# Altium project IOT_CPU_v0.PrjPcb
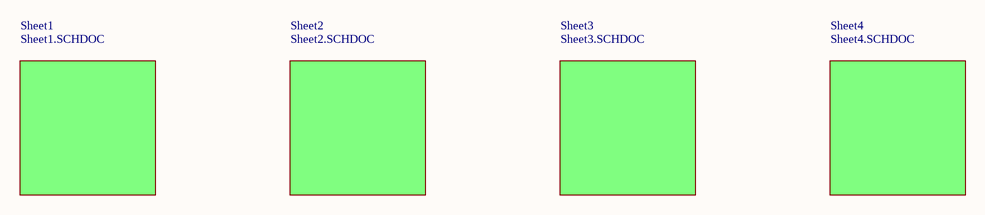
[diagram p0: First_Sheet.SCHDOC]
4 sheets, 118 parts. Net scope: global (net labels, ports and power ports of the same name join across sheets).
Board file: IOT_CPU_v0.PcbDoc
Sheets:
  First_Sheet.SCHDOC
    Sheet1 = Sheet1.SCHDOC
    Sheet3 = Sheet3.SCHDOC
    Sheet4 = Sheet4.SCHDOC

## Sheet First_Sheet.SCHDOC
size 593 x 439 mm

### Sub-sheets
Sheet1 = Sheet1.SCHDOC: no entries
Sheet2 = Sheet2.SCHDOC (file not in this document): no entries
Sheet3 = Sheet3.SCHDOC: no entries
Sheet4 = Sheet4.SCHDOC: no entries

## Sheet Sheet1.SCHDOC
size 593 x 439 mm; ApprovedBy: ГрибановСВ; CheckedBy: КычкинАВ; Author: СергеевДС; DocumentNumber: ЕМС.02.00.200 Э3; SheetNumber: 1; SheetTotal: 4; DocumentName: Sheet1.SCHDOC
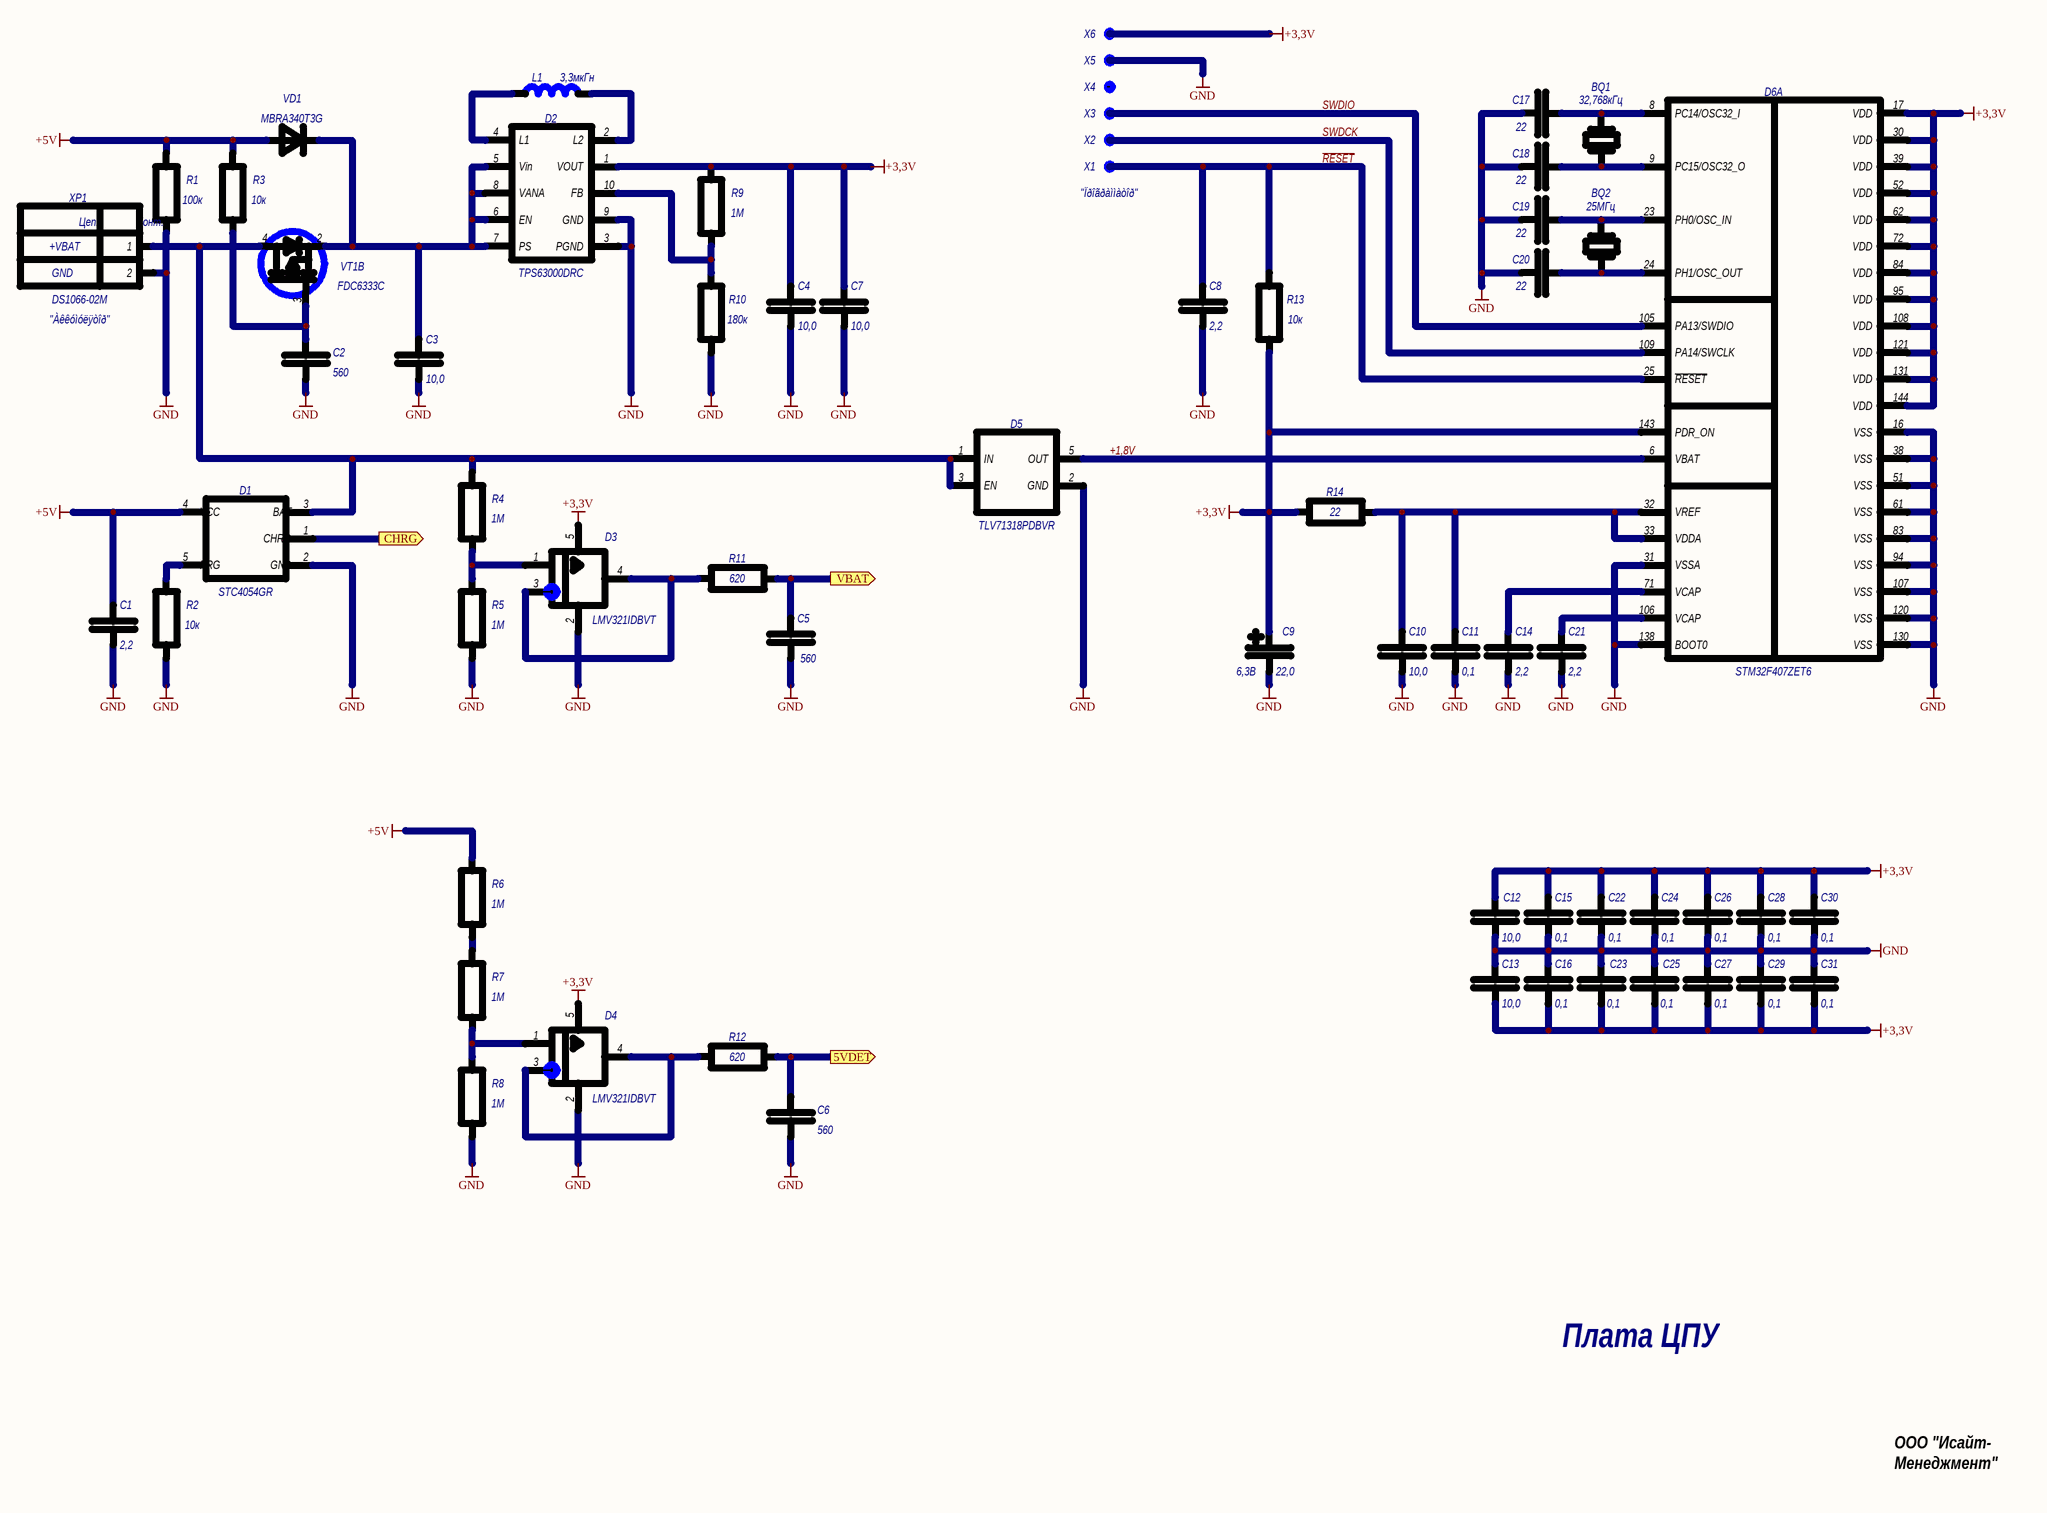
[diagram p1: Sheet1.SCHDOC]

### Parts
BQ1  DT38-32K768  [DT38]  (value not drawn)
BQ2  HC49U-06M  [HC49U]  (value not drawn)
C1  value 2,2  [0805]  (hidden comment: К0805)
C2  value 560  [0805]  (hidden comment: К0805)
C3  value 10,0  [0805]  (hidden comment: К0805)
C4  value 10,0  [0805]  (hidden comment: К0805)
C5  value 560  [0805]  (hidden comment: К0805)
C6  value 560  [0805]  (hidden comment: К0805)
C7  value 10,0  [0805]  (hidden comment: К0805)
C8  value 2,2  [0805]  (hidden comment: К0805)
C9  value 22,0  TG: 6,3В  [TANTAL]  (hidden comment: КТ)
C10  value 10,0  [0805]  (hidden comment: К0805)
C11  value 0,1  [0805]  (hidden comment: К0805)
C12  value 10,0  [0805]  (hidden comment: К0805)
C13  value 10,0  [0805]  (hidden comment: К0805)
C14  value 2,2  [0805]  (hidden comment: К0805)
C15  value 0,1  [0805]  (hidden comment: К0805)
C16  value 0,1  [0805]  (hidden comment: К0805)
C17  value 22  [0805]  (hidden comment: К0805)
C18  value 22  [0805]  (hidden comment: К0805)
C19  value 22  [0805]  (hidden comment: К0805)
C20  value 22  [0805]  (hidden comment: К0805)
C21  value 2,2  [0805]  (hidden comment: К0805)
C22  value 0,1  [0805]  (hidden comment: К0805)
C23  value 0,1  [0805]  (hidden comment: К0805)
C24  value 0,1  [0805]  (hidden comment: К0805)
C25  value 0,1  [0805]  (hidden comment: К0805)
C26  value 0,1  [0805]  (hidden comment: К0805)
C27  value 0,1  [0805]  (hidden comment: К0805)
C28  value 0,1  [0805]  (hidden comment: К0805)
C29  value 0,1  [0805]  (hidden comment: К0805)
C30  value 0,1  [0805]  (hidden comment: К0805)
C31  value 0,1  [0805]  (hidden comment: К0805)
D1  STC4054GR  [SOT-23-5]
D2  TPS63000DRC  [VSON-10]
D3  LMV321IDBVT  [SOT-23-5]
D4  LMV321IDBVT  [SOT-23-5]
D5  TLV71318PDBVR  [SOT-23-5]
D6  STM32F407ZET6  [LQFP-144]  (part A of 4)
L1  SRN3015-101M  [SRN3015]  (value not drawn)
R1  Р0805  [0805]  (value not drawn)
R2  Р0805  [0805]  (value not drawn)
R3  Р0805  [0805]  (value not drawn)
R4  value 1M  [0805]  (hidden comment: Р0805)
R5  value 1M  [0805]  (hidden comment: Р0805)
R6  value 1M  [0805]  (hidden comment: Р0805)
R7  value 1M  [0805]  (hidden comment: Р0805)
R8  value 1M  [0805]  (hidden comment: Р0805)
R9  value 1M  [0805]  (hidden comment: Р0805)
R10  Р0805  [0805]  (value not drawn)
R11  value 620  [0805]  (hidden comment: Р0805)
R12  value 620  [0805]  (hidden comment: Р0805)
R13  Р0805  [0805]  (value not drawn)
R14  value 22  [0805]  (hidden comment: Р0805)
VD1  MBRA340T3G  [SMA]
VT1  FDC6333C  [SOT-23-6]  (part B of 2)
X1  X  [01]  (value not drawn)
X2  X  [01]  (value not drawn)
X3  X  [01]  (value not drawn)
X4  X  [01]  (value not drawn)
X5  X  [01]  (value not drawn)
X6  X  [01]  (value not drawn)
XP1  DS1066-02M  2: GND  1: +VBAT  [DS1066-02M]

### Ports
5VDET (out), CHRG (out), VBAT (out)

### Nets
+3,3V: C4.2 C7.2 C9.1(Plus) C12.1 C13.1 C15.2 C16.1 C22.2 C23.2 C24.2 C25.2 C26.2 C27.1 C28.2 C29.1 C30.2 C31.1 D2.1(VOUT) D3.5(V) D4.5(V) D6.17(VDD) D6.30(VDD) D6.39(VDD) D6.52(VDD) D6.62(VDD) D6.72(VDD) D6.84(VDD) D6.95(VDD) D6.108(VDD) D6.121(VDD) D6.131(VDD) D6.143(PDR_ON) D6.144(VDD) R9.2 R13.1 R14.2 X6.1
+5V: C1.2 D1.4(VCC) R1.2 R3.2 R6.2 VD1.A(Anod)
GND: C1.1 C2.1 C3.1 C4.1 C5.2 C6.1 C7.1 C8.1 C9.2(Minus) C10.1 C11.1 C12.2 C13.2 C14.1 C15.1 C16.2 C17.2 C18.2 C19.2 C20.2 C21.1 C22.1 C23.1 C24.1 C25.1 C26.1 C27.2 C28.1 C29.2 C30.1 C31.2 D1.2(GND) D2.3(PGND) D2.9(GND) D2.11(GND) D3.2(G) D4.2(G) D5.2(GND) D6.16(VSS) D6.31(VSSA) D6.38(VSS) D6.51(VSS) D6.61(VSS) D6.83(VSS) D6.94(VSS) D6.107(VSS) D6.120(VSS) D6.130(VSS) D6.138(BOOT0) R1.1 R2.1 R5.1 R8.1 R10.1 X5.1 XP1.2
5VDET: C6.2 R12.1 ; port 5VDET
+1,8V: D5.5(OUT) D6.6(VBAT)
CHRG: D1.1(CHRG) ; port CHRG
~{RESET}: C8.2 D6.25(~{RESET}) R13.2 X1.1
SWDCK: D6.109(PA14/SWCLK) X2.1
SWDIO: D6.105(PA13/SWDIO) X3.1
VBAT: C5.1 R11.1 ; port VBAT
NetBQ1_1: BQ1.1 C18.1 D6.9(PC15/OSC32_O)
NetBQ1_2: BQ1.2 C17.1 D6.8(PC14/OSC32_I)
NetBQ2_1: BQ2.1 C20.1 D6.24(PH1/OSC_OUT)
NetBQ2_2: BQ2.2 C19.1 D6.23(PH0/OSC_IN)
NetC2_2: C2.2 R3.1 VT1.3(Gate)
NetC3_2: C3.2 D2.5(Vin) D2.6(EN) D2.7(PS) D2.8(VANA) VD1.K(Katod) VT1.2(Source)
NetC10_2: C10.2 C11.2 D6.32(VREF) D6.33(VDDA) R14.1
NetC14_2: C14.2 D6.71(VCAP)
NetC21_2: C21.2 D6.106(VCAP)
NetD1_3: D1.3(BAT) D5.1(IN) D5.3(EN) R4.2 VT1.4(Drain) XP1.1
NetD1_5: D1.5(PRG) R2.2
NetD2_2: D2.2(L2) L1.2
NetD2_4: D2.4(L1) L1.1
NetD2_10: D2.10(FB) R9.1 R10.2
NetD3_1: D3.1(+IN) R4.1 R5.2
NetD3_3: D3.3(-IN) D3.4(OUT) R11.2
NetD4_1: D4.1(+IN) R7.2 R8.2
NetD4_3: D4.3(-IN) D4.4(OUT) R12.2
NetR6_1: R6.1 R7.1

Not connected (* = marked no-connect by the designer): D5 4; D6 49; X4 1

### Notes on the sheet
- (near X1) "Ïðîãðàììàòîð"
- (near XP1) "Àêêóìóëÿòîð"
- Плата ЦПУ
- ООО "Исайт-
  Менеджмент"
- Перв. примен.
- Справ. №
- Подп. и дата
- Инв. № дубл.
- Взам. инв. №
- Изм.
- Лист
- № докум.
- Подп.
- Дата
- Литера
- Масса
- Масштаб
- Пров.
- Разраб.
- О
- 1
- _
- Инв. № подл.
- Н.контр.
- Схема электрическая
  принципиальная
- Листов
- Утв.
- (in symbol DS1066-02M) Цепь; Конт.
- (in symbol DT38-32K768) 32,768кГц
- (in symbol HC49U-06M) 25МГц
- (in symbol SRN3015-101M) 3,3мкГн
- (in symbol Р0805) 100к; 10к; 180к

### Library data of the parts
BQ1 = DT38-32K768: РЕЗОНАТОР; TG: {TG}; TO: 020, 180/3x8/ASC327; TU: {TU}; NO: 0522; RefDes2: {RefDes2}; ComponentHeight: {ComponentHeight}
BQ2 = HC49U-06M: РЕЗОНАТОР; TG: {TG}; TO: 020, 211/-/6.000; TU: {TU}; NO: 2491; RefDes2: {RefDes2}; ComponentHeight: {ComponentHeight}
C1-C8 C10-C31 = К0805: КОНДЕНСАТОР; TG: NP0; TO: 5%; TU: {TU}; NO: {NO}; RefDes2: {RefDes2}; ComponentHeight: 1
C9 = КТ: КОНДЕНСАТОР; TU: {TU}; TO: {TO}; NO: {NO}; RefDes2: {RefDes2}; ComponentHeight: {ComponentHeight}
D1 = STC4054GR: {Description}; NO: {NO}; TG: {TG}; TO: {TO}; TU: {TU}; RefDes2: {RefDes2}; ComponentHeight: {ComponentHeight}
D2 = TPS63000DRC: {Description}; TU: {TU}; TG: {TG}; TO: {TO}; NO: {NO}; ComponentHeight: {ComponentHeight}
D3 D4 = LMV321IDBVT: {Description}; TU: {TU}; TG: {TG}; TO: {TO}; NO: {NO}; RefDes2: {RefDes2}; ComponentHeight: {ComponentHeight}
D5 = TLV71318PDBVR: {Description}; NO: {NO}; TG: {TG}; TO: {TO}; TU: {TU}; RefDes2: {RefDes2}; ComponentHeight: {ComponentHeight}
L1 = SRN3015-101M: {Description}; TU: {TU}; TO: {TO}; TG: {TG}; NO: {NO}; RefDes2: {RefDes2}; ComponentHeight: {ComponentHeight}
R1-R14 = Р0805: РЕЗИСТОР; TG: 0,125; TO: 1%; TU: {TU}; NO: {NO}; RefDes2: {RefDes2}; ComponentHeight: 1
VD1 = MBRA340T3G: {Description}; TU: {TU}; TG: {TG}; RefDes2: {RefDes2}; TO: {TO}; NO: {NO}; ComponentHeight: {ComponentHeight}
VT1 = FDC6333C: {Description}; TO: {TO}; TU: {TU}; NO: {NO}; RefDes2: {RefDes2}; TG: {TG}; ComponentHeight: {ComponentHeight}
X1-X6 = X: КОНТАКТ; TG: {TG}; TO: {TO}; TU: {TU}; NO: {NO}; RefDes2: {RefDes2}; ComponentHeight: 0.1
XP1 = DS1066-02M: {Description}; TU: {TU}; TG: {TG}; RefDes2: {RefDes2}; TO: {TO}; NO: {NO}; ComponentHeight: {ComponentHeight}

## Sheet Sheet3.SCHDOC
size 593 x 439 mm; DocumentNumber: ЕМС.02.00.200 Э3; SheetNumber: 3; SheetTotal: 4; DocumentName: Sheet3.SCHDOC
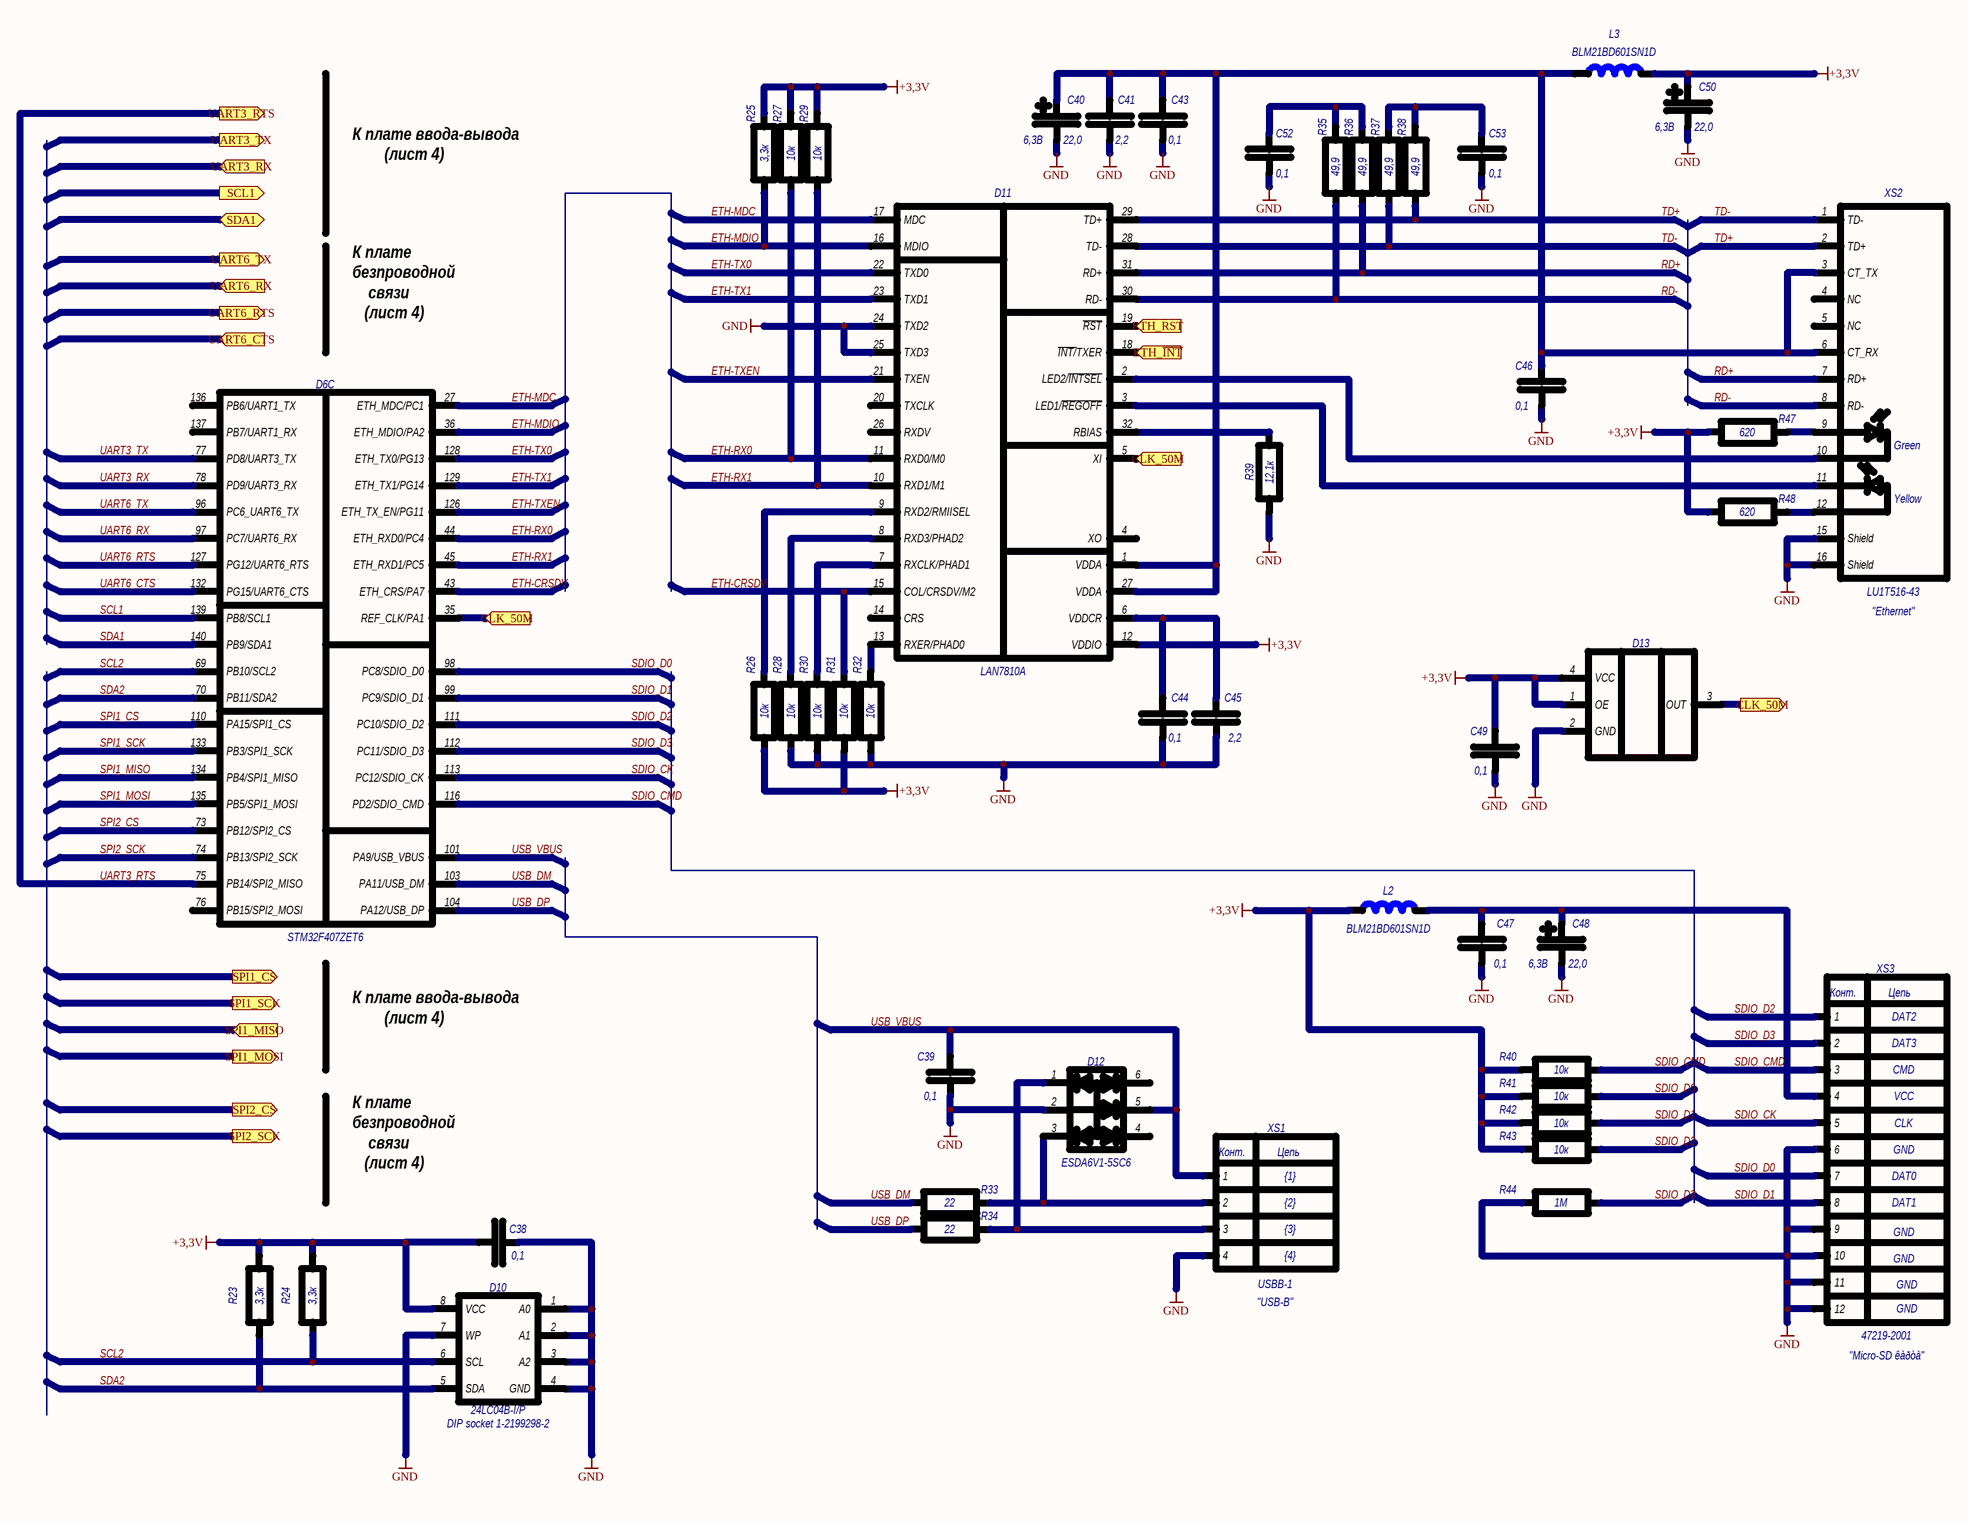
[diagram p2: Sheet3.SCHDOC]

### Parts
C38  value 0,1  [0805]  (hidden comment: К0805)
C39  value 0,1  [0805]  (hidden comment: К0805)
C40  value 22,0  TG: 6,3В  [TANTAL]  (hidden comment: КТ)
C41  value 2,2  [0805]  (hidden comment: К0805)
C43  value 0,1  [0805]  (hidden comment: К0805)
C44  value 0,1  [0805]  (hidden comment: К0805)
C45  value 2,2  [0805]  (hidden comment: К0805)
C46  value 0,1  [0805]  (hidden comment: К0805)
C47  value 0,1  [0805]  (hidden comment: К0805)
C48  value 22,0  TG: 6,3В  [TANTAL]  (hidden comment: КТ)
C49  value 0,1  [0805]  (hidden comment: К0805)
C50  value 22,0  TG: 6,3В  [TANTAL]  (hidden comment: КТ)
C52  value 0,1  [0805]  (hidden comment: К0805)
C53  value 0,1  [0805]  (hidden comment: К0805)
D6  STM32F407ZET6  [LQFP-144]  (part C of 4)
D10  24LC04B-I/P  value DIP socket 1-2199298-2  [DIP-08]
D11  LAN7810A  [QFN-32-5X5]
D12  ESDA6V1-5SC6  [SOT-23-6]
D13  KXO-V97  [SG0705]  (value not drawn)
L2  value BLM21BD601SN1D  [0805]  (hidden comment: BLM21BD222)
L3  value BLM21BD601SN1D  [0805]  (hidden comment: BLM21BD222)
R23  Р0805  [0805]  (value not drawn)
R24  Р0805  [0805]  (value not drawn)
R25  Р0805  [0805]  (value not drawn)
R26  Р0805  [0805]  (value not drawn)
R27  Р0805  [0805]  (value not drawn)
R28  Р0805  [0805]  (value not drawn)
R29  Р0805  [0805]  (value not drawn)
R30  Р0805  [0805]  (value not drawn)
R31  Р0805  [0805]  (value not drawn)
R32  Р0805  [0805]  (value not drawn)
R33  value 22  [0805]  (hidden comment: Р0805)
R34  value 22  [0805]  (hidden comment: Р0805)
R35  value 49,9  [0805]  (hidden comment: Р0805)
R36  value 49,9  [0805]  (hidden comment: Р0805)
R37  value 49,9  [0805]  (hidden comment: Р0805)
R38  value 49,9  [0805]  (hidden comment: Р0805)
R39  Р0805  [0805]  (value not drawn)
R40  Р0805  [0805]  (value not drawn)
R41  Р0805  [0805]  (value not drawn)
R42  Р0805  [0805]  (value not drawn)
R43  Р0805  [0805]  (value not drawn)
R44  value 1M  [0805]  (hidden comment: Р0805)
R47  value 620  [0805]  (hidden comment: Р0805)
R48  value 620  [0805]  (hidden comment: Р0805)
XS1  USBB-1  4: {4}  1: {1}  2: {2}  3: {3}  [USB-B]
XS2  LU1T516-43  [LU1T516-43]
XS3  47219-2001  10: GND  7: DAT0  5: CLK  4: VCC  2: DAT3  1: DAT2  8: DAT1  3: CMD  [47219-2001]

### Ports
CLK_50M (in), CLK_50M (out), ETH_RST (in), ETH_~{INT} (in), SCL1 (out), SDA1 (bidir), SPI1_CS (out), SPI1_MISO (in), SPI1_MOSI (out), SPI1_SCK (out), SPI2_CS (out), SPI2_SCK (out), UART3_RTS (out), UART3_RX (in), UART3_TX (out), UART6_CTS (in), UART6_RTS (out), UART6_RX (in), UART6_TX (out)

### Nets
+3,3V: C38.1 C49.2 C50.1(Plus) D10.8(VCC) D11.12(VDDIO) D13.1(OE) D13.4(VCC) L2.2 L3.2 R23.2 R24.2 R25.2 R26.2 R27.2 R29.2 R31.2 R40.2 R41.2 R42.2 R43.2 R47.1 R48.1
GND: C38.2 C39.1 C40.2(Minus) C41.2 C43.2 C44.2 C45.2 C46.1 C47.2 C48.2(Minus) C49.1 C50.2(Minus) C52.1 C53.1 D10.1(A0) D10.2(A1) D10.3(A2) D10.4(GND) D10.7(WP) D11.24(TXD2) D11.25(TXD3) D11.33(GND) D11.34(GND) D11.35(GND) D11.36(GND) D12.2 D13.2(GND) R28.2 R30.2 R32.2 R39.2 R44.2 XS1.4 XS2.15(Shield) XS2.16(Shield) XS3.6 XS3.9 XS3.10 XS3.11 XS3.12
CLK_50M: D6.35(REF_CLK/PA1) D11.5(XI) D13.3(OUT) ; port CLK_50M
ETH-CRSDV: D6.43(ETH_CRS/PA7) D11.15(COL/CRSDV/M2) R31.1
ETH-MDC: D6.27(ETH_MDC/PC1) D11.17(MDC)
ETH-MDIO: D6.36(ETH_MDIO/PA2) D11.16(MDIO) R25.1
ETH-RX0: D6.44(ETH_RXD0/PC4) D11.11(RXD0/M0) R27.1
ETH-RX1: D6.45(ETH_RXD1/PC5) D11.10(RXD1/M1) R29.1
ETH-TX0: D6.128(ETH_TX0/PG13) D11.22(TXD0)
ETH-TX1: D6.129(ETH_TX1/PG14) D11.23(TXD1)
ETH-TXEN: D6.126(ETH_TX_EN/PG11) D11.21(TXEN)
ETH_~{INT}: D11.18(~{INT/}TXER) ; port ETH_~{INT}
ETH_RST: D11.19(~{RST}) ; port ETH_RST
RD+: D11.31(RD+) R36.1 XS2.7(RD+)
RD-: D11.30(RD-) R35.1 XS2.8(RD-)
SCL1: D6.139(PB8/SCL1)
SCL2: D6.69(PB10/SCL2) D10.6(SCL) R24.1
SDA1: D6.140(PB9/SDA1)
SDA2: D6.70(PB11/SDA2) D10.5(SDA) R23.1
SDIO_CK: D6.113(PC12/SDIO_CK) XS3.5
SDIO_CMD: D6.116(PD2/SDIO_CMD) R40.1 XS3.3
SDIO_D0: D6.98(PC8/SDIO_D0) R41.1 XS3.7
SDIO_D1: D6.99(PC9/SDIO_D1) R42.1 XS3.8
SDIO_D2: D6.111(PC10/SDIO_D2) R43.1 XS3.1
SDIO_D3: D6.112(PC11/SDIO_D3) R44.1 XS3.2
SPI1_CS: D6.110(PA15/SPI1_CS)
SPI1_MISO: D6.134(PB4/SPI1_MISO)
SPI1_MOSI: D6.135(PB5/SPI1_MOSI)
SPI1_SCK: D6.133(PB3/SPI1_SCK)
SPI2_CS: D6.73(PB12/SPI2_CS)
SPI2_SCK: D6.74(PB13/SPI2_SCK)
TD+: D11.29(TD+) R38.1 XS2.2(TD+)
TD-: D11.28(TD-) R37.1 XS2.1(TD-)
UART3_RTS: D6.75(PB14/SPI2_MISO) ; port UART3_RTS
UART3_RX: D6.78(PD9/UART3_RX)
UART3_TX: D6.77(PD8/UART3_TX)
UART6_CTS: D6.132(PG15/UART6_CTS)
UART6_RTS: D6.127(PG12/UART6_RTS)
UART6_RX: D6.97(PC7/UART6_RX)
UART6_TX: D6.96(PC6_UART6_TX)
USB_DM: D6.103(PA11/USB_DM) R33.2
USB_DP: D6.104(PA12/USB_DP) R34.2
USB_VBUS: C39.2 D6.101(PA9/USB_VBUS) D12.5(C) XS1.1
NetC40_1: C40.1(Plus) C41.1 C43.1 C46.2 D11.1(VDDA) D11.27(VDDA) L3.1 XS2.3(CT_TX) XS2.6(CT_RX)
NetC44_1: C44.1 C45.1 D11.6(VDDCR)
NetC47_1: C47.1 C48.1(Plus) L2.1 XS3.4
NetC52_2: C52.2 R35.2 R36.2
NetC53_2: C53.2 R37.2 R38.2
NetD11_2: D11.2(LED2/~{INTSEL}) XS2.10
NetD11_3: D11.3(LED1/~{REGOFF}) XS2.11
NetD11_7: D11.7(RXCLK/PHAD1) R30.1
NetD11_8: D11.8(RXD3/PHAD2) R28.1
NetD11_9: D11.9(RXD2/RMIISEL) R26.1
NetD11_13: D11.13(RXER/PHAD0) R32.1
NetD11_32: D11.32(RBIAS) R39.1
NetD12_1: D12.1 R34.1 XS1.3
NetD12_3: D12.3 R33.1 XS1.2
NetR47_2: R47.2 XS2.9
NetR48_2: R48.2 XS2.12

Not connected (* = marked no-connect by the designer): D6 49 76(PB15/SPI2_MOSI) 136(PB6/UART1_TX) 137(PB7/UART1_RX); D11 4(XO) 14(CRS) 20(TXCLK) 26(RXDV); D12 4 6(C); XS2 4(NC) 5(NC) 13 14

### Notes on the sheet
- К плате ввода-вывода
  (лист 4)
- (near D6) К плате
  безпроводной
  связи
  (лист 4)
- (near XS2) "Ethernet"
- (near C38) К плате
  безпроводной
  связи
  (лист 4)
- "USB-B"
- (near XS3) "Micro-SD êàðòà"
- Подп. и дата
- Инв. № дубл.
- Взам. инв. №
- Инв. № подл.
- Лист
- Изм.
- № докум.
- Подп.
- Дата
- (in symbol 47219-2001) Конт.; Цепь
- (in symbol LU1T516-43) Green; Yellow
- (in symbol USBB-1) Конт.; Цепь
- (in symbol Р0805) 10к; 3,3к; 12,1к

### Library data of the parts
C38 C39 C41 C43-C47 C52 C53 = К0805: as C1 on sheet Sheet1; ComponentHeight: 1
C40 C48 C50 = КТ: as C9 on sheet Sheet1; ComponentHeight: {ComponentHeight}
C49 = К0805_VARIANT_1: КОНДЕНСАТОР; TG: NP0; TO: 5%; TU: {TU}; NO: {NO}; RefDes2: {RefDes2}; ComponentHeight: 1
D12 = ESDA6V1-5SC6: {Description}; NO: {NO}; TG: {TG}; TO: {TO}; TU: {TU}; RefDes2: {RefDes2}; ComponentHeight: {ComponentHeight}
L2 L3 = BLM21BD222: {Description}; TU: {TU}; TO: {TO}; TG: {TG}; NO: {NO}; RefDes2: {RefDes2}; ComponentHeight: {ComponentHeight}
R23-R44 R47 R48 = Р0805: as R1 on sheet Sheet1; ComponentHeight: 1
XS1 = USBB-1: РОЗЕТКА; TU: {TU}; TG: {TG}; TO: {TO}; NO: 2436; RefDes2: {RefDes2}; N1: 1; ComponentHeight: 11.2
XS2 = LU1T516-43: РОЗЕТКА; TU: {TU}; TO: {TO}; NO: 2037; TG: {TG}; RefDes2: {RefDes2}; ComponentHeight: {ComponentHeight}
XS3 = 47219-2001: {Description}; TG: {TG}; TO: {TO}; RefDes2: {RefDes2}; TU: {TU}; NO: {NO}; 9: GND; 11: GND; 12: GND; 6: GND; ComponentHeight: {ComponentHeight}
D13 = KXO-V97: Value: *

## Sheet Sheet4.SCHDOC
size 593 x 439 mm; DocumentNumber: ЕМС.02.00.200 Э3; SheetNumber: 4; SheetTotal: 4; DocumentName: Sheet4.SCHDOC
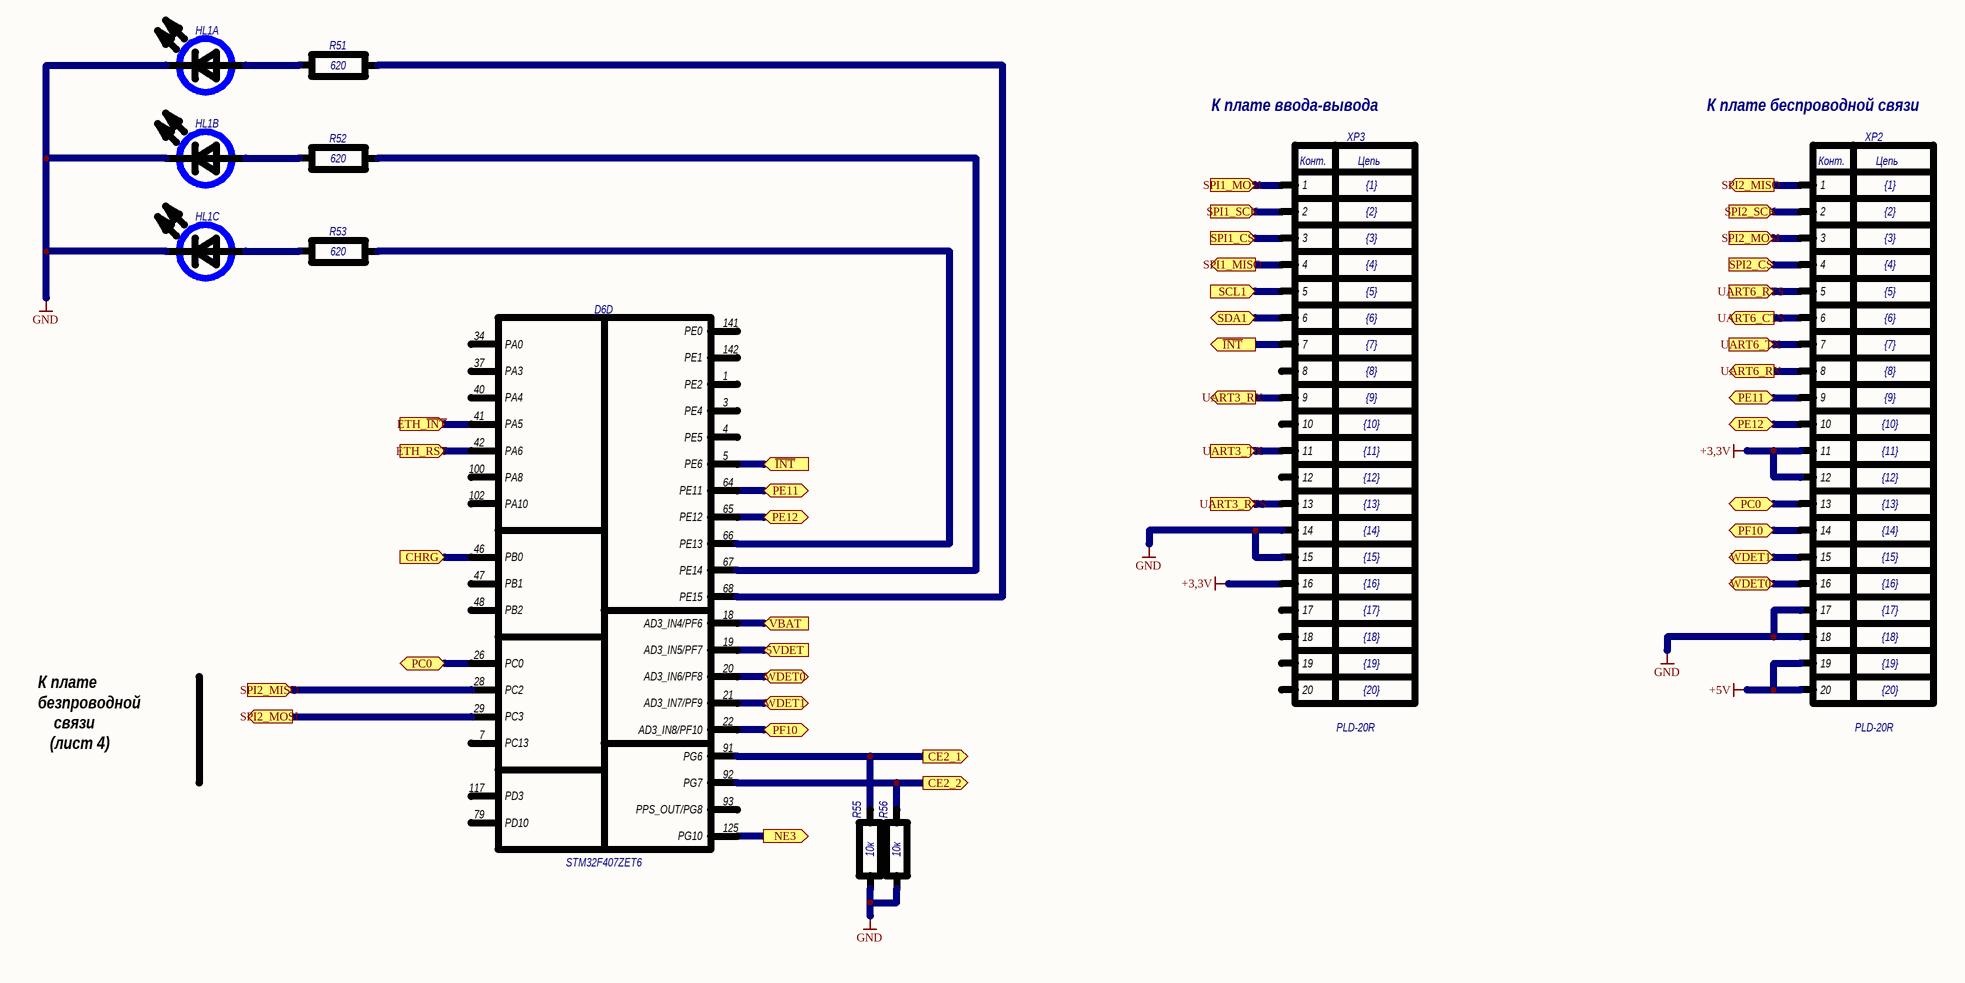
[diagram p3: Sheet4.SCHDOC]

### Parts
D6  STM32F407ZET6  [LQFP-144]  (part D of 4)
HL1  L-7104SA-3GD  [L-7104SA-3GD]  (value not drawn)  (parts A,B,C of 3)
R51  value 620  [0805]  (hidden comment: Р0805)
R52  value 620  [0805]  (hidden comment: Р0805)
R53  value 620  [0805]  (hidden comment: Р0805)
R55  Р0805  [0805]  (value not drawn)
R56  Р0805  [0805]  (value not drawn)
XP2  PLD-20R  18: {18}  15: {15}  12: {12}  9: {9}  6: {6}  3: {3}  1: {1}  19: {19}  16: {16}  20: {20}  17: {17}  13: {13}  10: {10}  14: {14}  11: {11}  7: {7}  4: {4}  8: {8}  5: {5}  2: {2}  [PLD-20R]
XP3  PLD-20R  18: {18}  15: {15}  12: {12}  9: {9}  6: {6}  3: {3}  1: {1}  19: {19}  16: {16}  20: {20}  17: {17}  13: {13}  10: {10}  14: {14}  11: {11}  7: {7}  4: {4}  8: {8}  5: {5}  2: {2}  [PLD-20R]

### Ports
5VDET (in), CE2_1 (out), CE2_2 (out), CHRG (in), ETH_RST (in), ETH_~{INT} (in), NE3 (out), PC0 (bidir), PE11 (bidir), PE12 (bidir), PF10 (bidir), SCL1 (in), SDA1 (bidir), SPI1_CS (in), SPI1_MISO (out), SPI1_MOSI (in), SPI1_SCK (in), SPI2_CS (in), SPI2_MISO (in), SPI2_MISO (out), SPI2_MOSI (in), SPI2_MOSI (out), SPI2_SCK (in), UART3_RTS (in), UART3_RX (out), UART3_TX (in), UART6_CTS (out), UART6_RTS (in), UART6_RX (out), UART6_TX (in), VBAT (in), WDET0 (bidir), WDET1 (bidir), ~{INT} (in), ~{INT} (out)

### Nets
+3,3V: XP2.11 XP2.12 XP3.16
+5V: XP2.19 XP2.20
GND: HL1.2 HL1.4 HL1.6 R55.1 R56.1 XP2.17 XP2.18 XP3.14 XP3.15
5VDET: D6.19(AD3_IN5/PF7) ; port 5VDET
CE2_1: D6.91(PG6) R55.2 ; port CE2_1
CE2_2: D6.92(PG7) R56.2 ; port CE2_2
CHRG: D6.46(PB0) ; port CHRG
ETH_~{INT}: D6.41(PA5) ; port ETH_~{INT}
ETH_RST: D6.42(PA6) ; port ETH_RST
~{INT}: D6.5(PE6) XP3.7 ; port ~{INT}
NE3: D6.125(PG10) ; port NE3
PC0: D6.26(PC0) XP2.13 ; port PC0
PE11: D6.64(PE11) XP2.9 ; port PE11
PE12: D6.65(PE12) XP2.10 ; port PE12
PF10: D6.22(AD3_IN8/PF10) XP2.14 ; port PF10
SCL1: XP3.5 ; port SCL1
SDA1: XP3.6 ; port SDA1
SPI1_CS: XP3.3 ; port SPI1_CS
SPI1_MISO: XP3.4 ; port SPI1_MISO
SPI1_MOSI: XP3.1 ; port SPI1_MOSI
SPI1_SCK: XP3.2 ; port SPI1_SCK
SPI2_CS: XP2.4 ; port SPI2_CS
SPI2_MISO: D6.28(PC2) XP2.1 ; port SPI2_MISO
SPI2_MOSI: D6.29(PC3) XP2.3 ; port SPI2_MOSI
SPI2_SCK: XP2.2 ; port SPI2_SCK
UART3_RTS: XP3.13 ; port UART3_RTS
UART3_RX: XP3.9 ; port UART3_RX
UART3_TX: XP3.11 ; port UART3_TX
UART6_CTS: XP2.6 ; port UART6_CTS
UART6_RTS: XP2.5 ; port UART6_RTS
UART6_RX: XP2.8 ; port UART6_RX
UART6_TX: XP2.7 ; port UART6_TX
VBAT: D6.18(AD3_IN4/PF6) ; port VBAT
WDET0: D6.20(AD3_IN6/PF8) XP2.16 ; port WDET0
WDET1: D6.21(AD3_IN7/PF9) XP2.15 ; port WDET1
NetD6_66: D6.66(PE13) R53.2
NetD6_67: D6.67(PE14) R52.2
NetD6_68: D6.68(PE15) R51.2
NetHL1_1: HL1.1 R51.1
NetHL1_3: HL1.3 R52.1
NetHL1_5: HL1.5 R53.1

Not connected (* = marked no-connect by the designer): D6 1(PE2) 3(PE4) 4(PE5) 7(PC13) 34(PA0) 37(PA3) 40(PA4) 47(PB1) 48(PB2) 49 79(PD10) 93(PPS_OUT/PG8) 100(PA8) 102(PA10) 117(PD3) 141(PE0) 142(PE1); XP3 8 10 12 17 18 19 20

### Notes on the sheet
- К плате ввода-вывода
- К плате беспроводной связи
- К плате
  безпроводной
  связи
  (лист 4)
- Подп. и дата
- Инв. № дубл.
- Взам. инв. №
- Инв. № подл.
- Лист
- Изм.
- № докум.
- Подп.
- Дата
- (in symbol PLD-20R) Конт.; Цепь
- (in symbol Р0805) 10к

### Library data of the parts
HL1 = L-7104SA-3GD: {Description}; 1: k; 2: a; TU: {TU}; TG: {TG}; TO: {TO}; NO: {NO}; RefDes2: {RefDes2}; ComponentHeight: {ComponentHeight}
R51-R53 R55 R56 = Р0805: as R1 on sheet Sheet1; ComponentHeight: 1
XP2 XP3 = PLD-20R: {Description}; TU: {TU}; TG: {TG}; RefDes2: {RefDes2}; TO: {TO}; NO: {NO}; ComponentHeight: {ComponentHeight}

## Nets that join several sheets
+3,3V: Sheet1 (37 pins), Sheet3 (22 pins), Sheet4 (XP2.11 XP2.12 XP3.16)
+5V: Sheet1 (6 pins), Sheet4 (XP2.19 XP2.20)
GND: Sheet1 (56 pins), Sheet3 (40 pins), Sheet4 (9 pins)
5VDET: Sheet1 (C6.2 R12.1), Sheet4 (D6.19)
CHRG: Sheet1 (D1.1), Sheet4 (D6.46)
ETH_~{INT}: Sheet3 (D11.18), Sheet4 (D6.41)
ETH_RST: Sheet3 (D11.19), Sheet4 (D6.42)
NetD6_49: Sheet1 (D6.49), Sheet3 (D6.49), Sheet4 (D6.49)
UART3_RTS: Sheet3 (D6.75), Sheet4 (XP3.13)
VBAT: Sheet1 (C5.1 R11.1), Sheet4 (D6.18)